# Altium schematic sheet [06] - MICRO CONTROLLER CONNECTORS.SchDoc (part 1 of 2)
size A1; Organization: Altium Limited; Address1: L3, 12a Rodborough Rd; Address2: Frenchs Forest; Address3: NSW; Address4: Australia 2086; DocumentNumber: 6; SheetNumber: 6; SheetTotal: 11
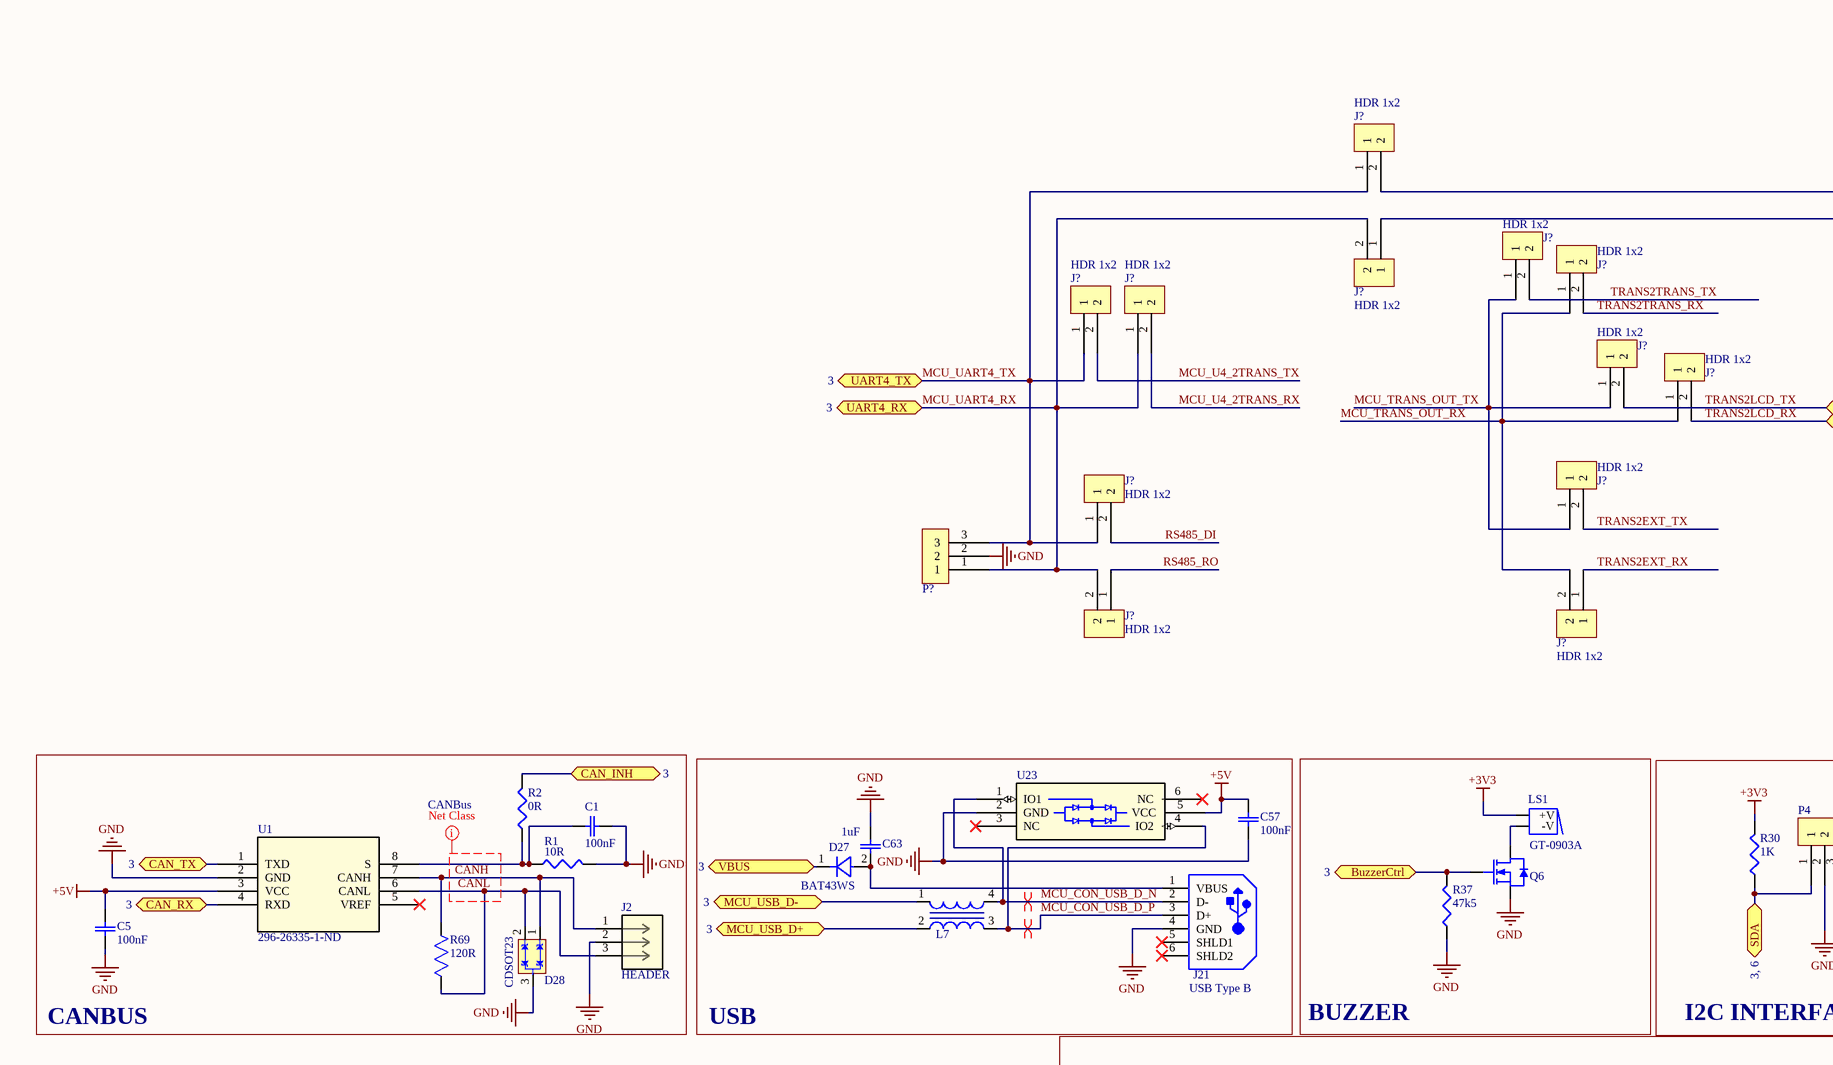
[diagram p0: [06] - MICRO CONTROLLER CONNECTORS.SchDoc, top left]
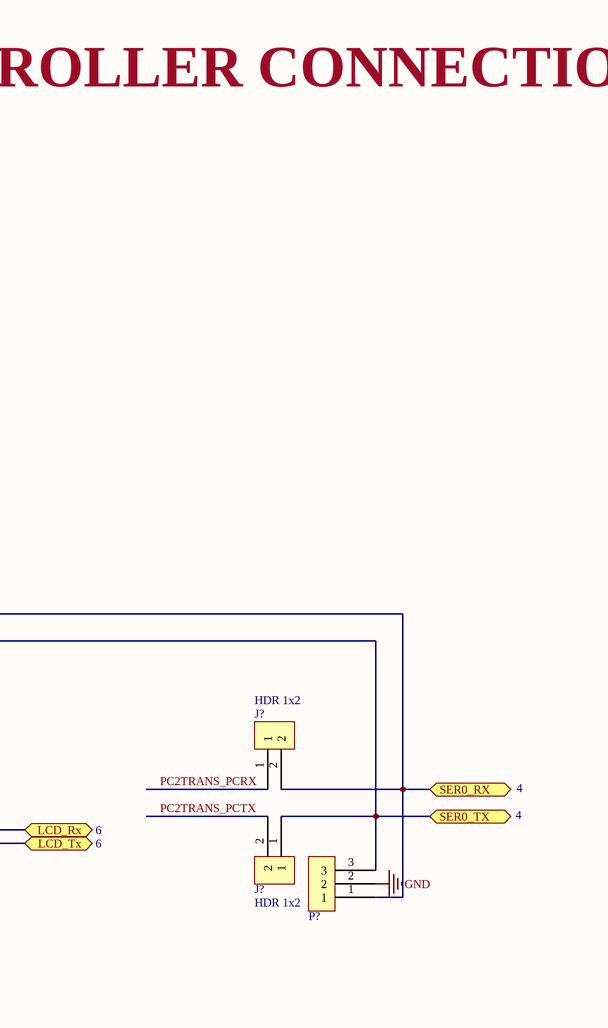
[diagram p1: [06] - MICRO CONTROLLER CONNECTORS.SchDoc, top right]
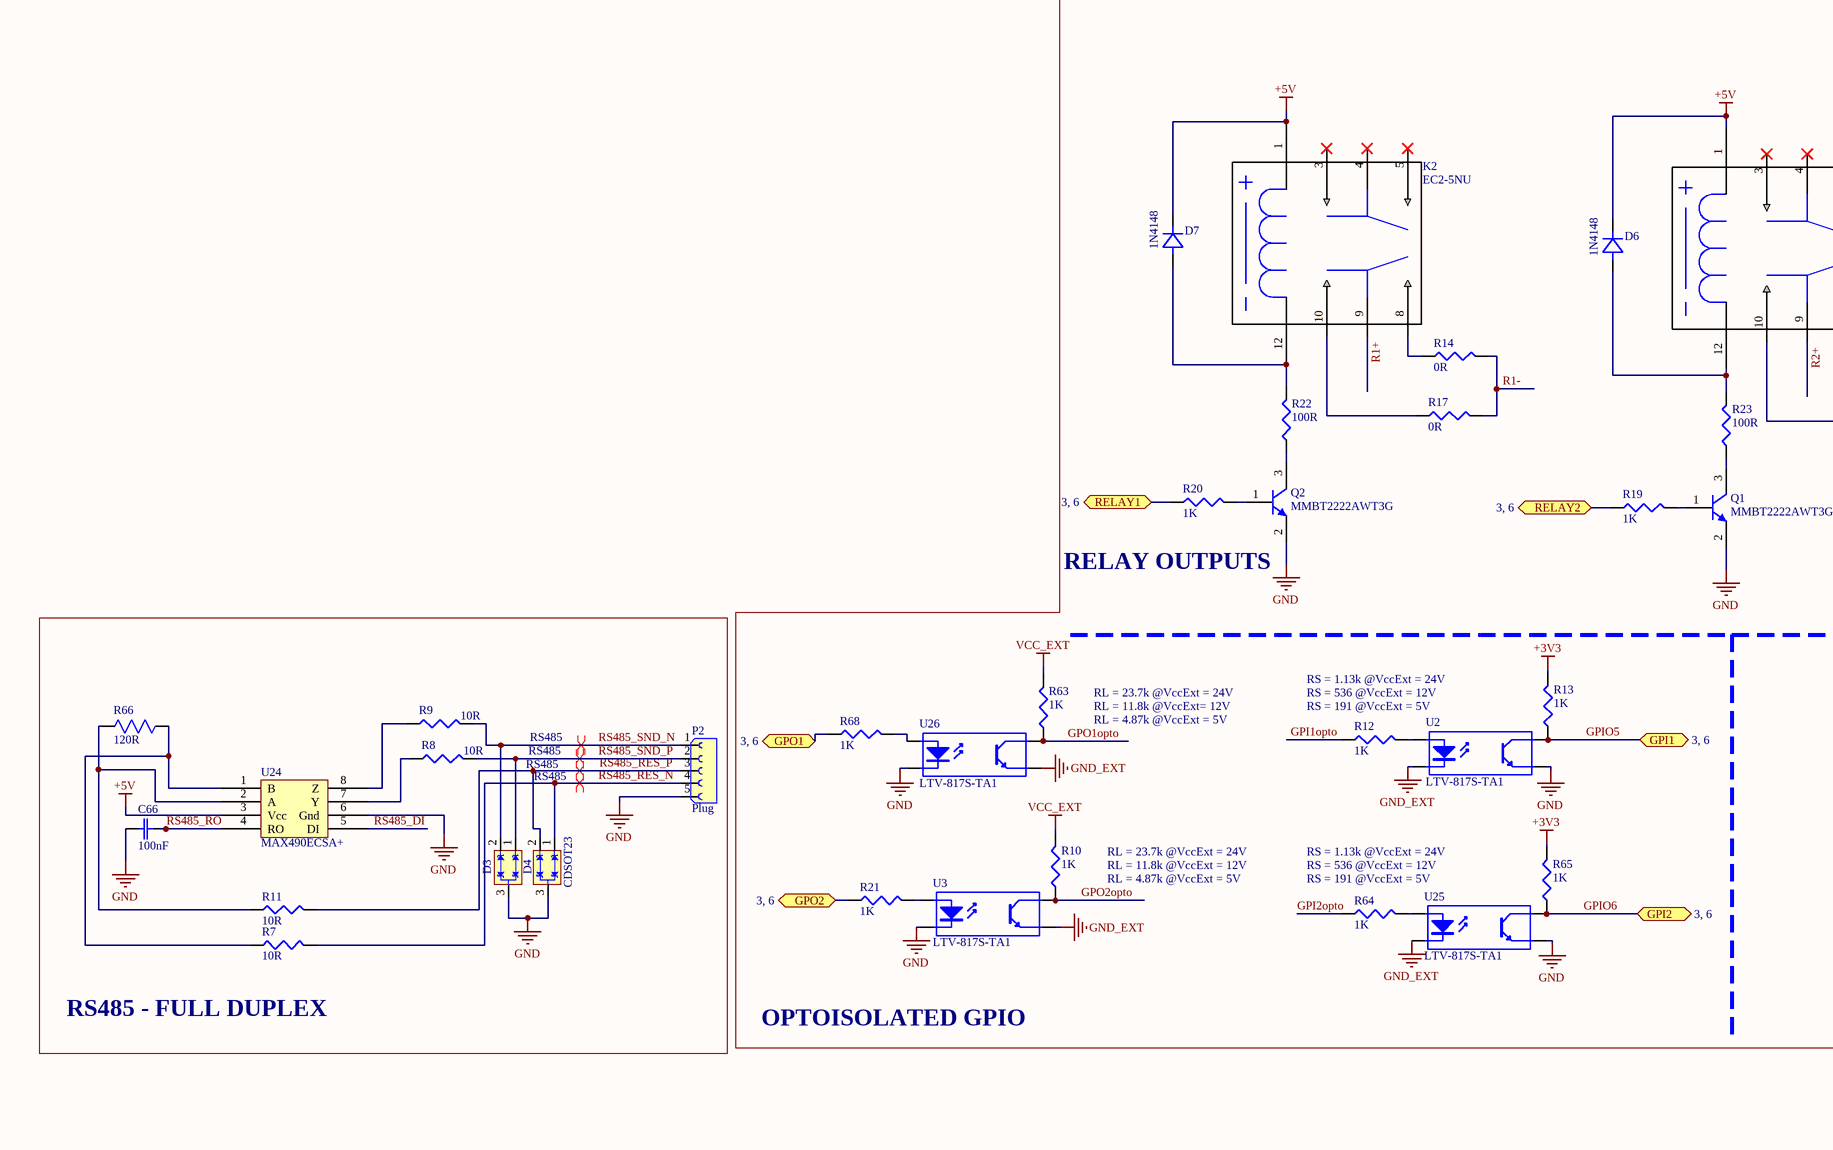
[diagram p2: [06] - MICRO CONTROLLER CONNECTORS.SchDoc, bottom left]
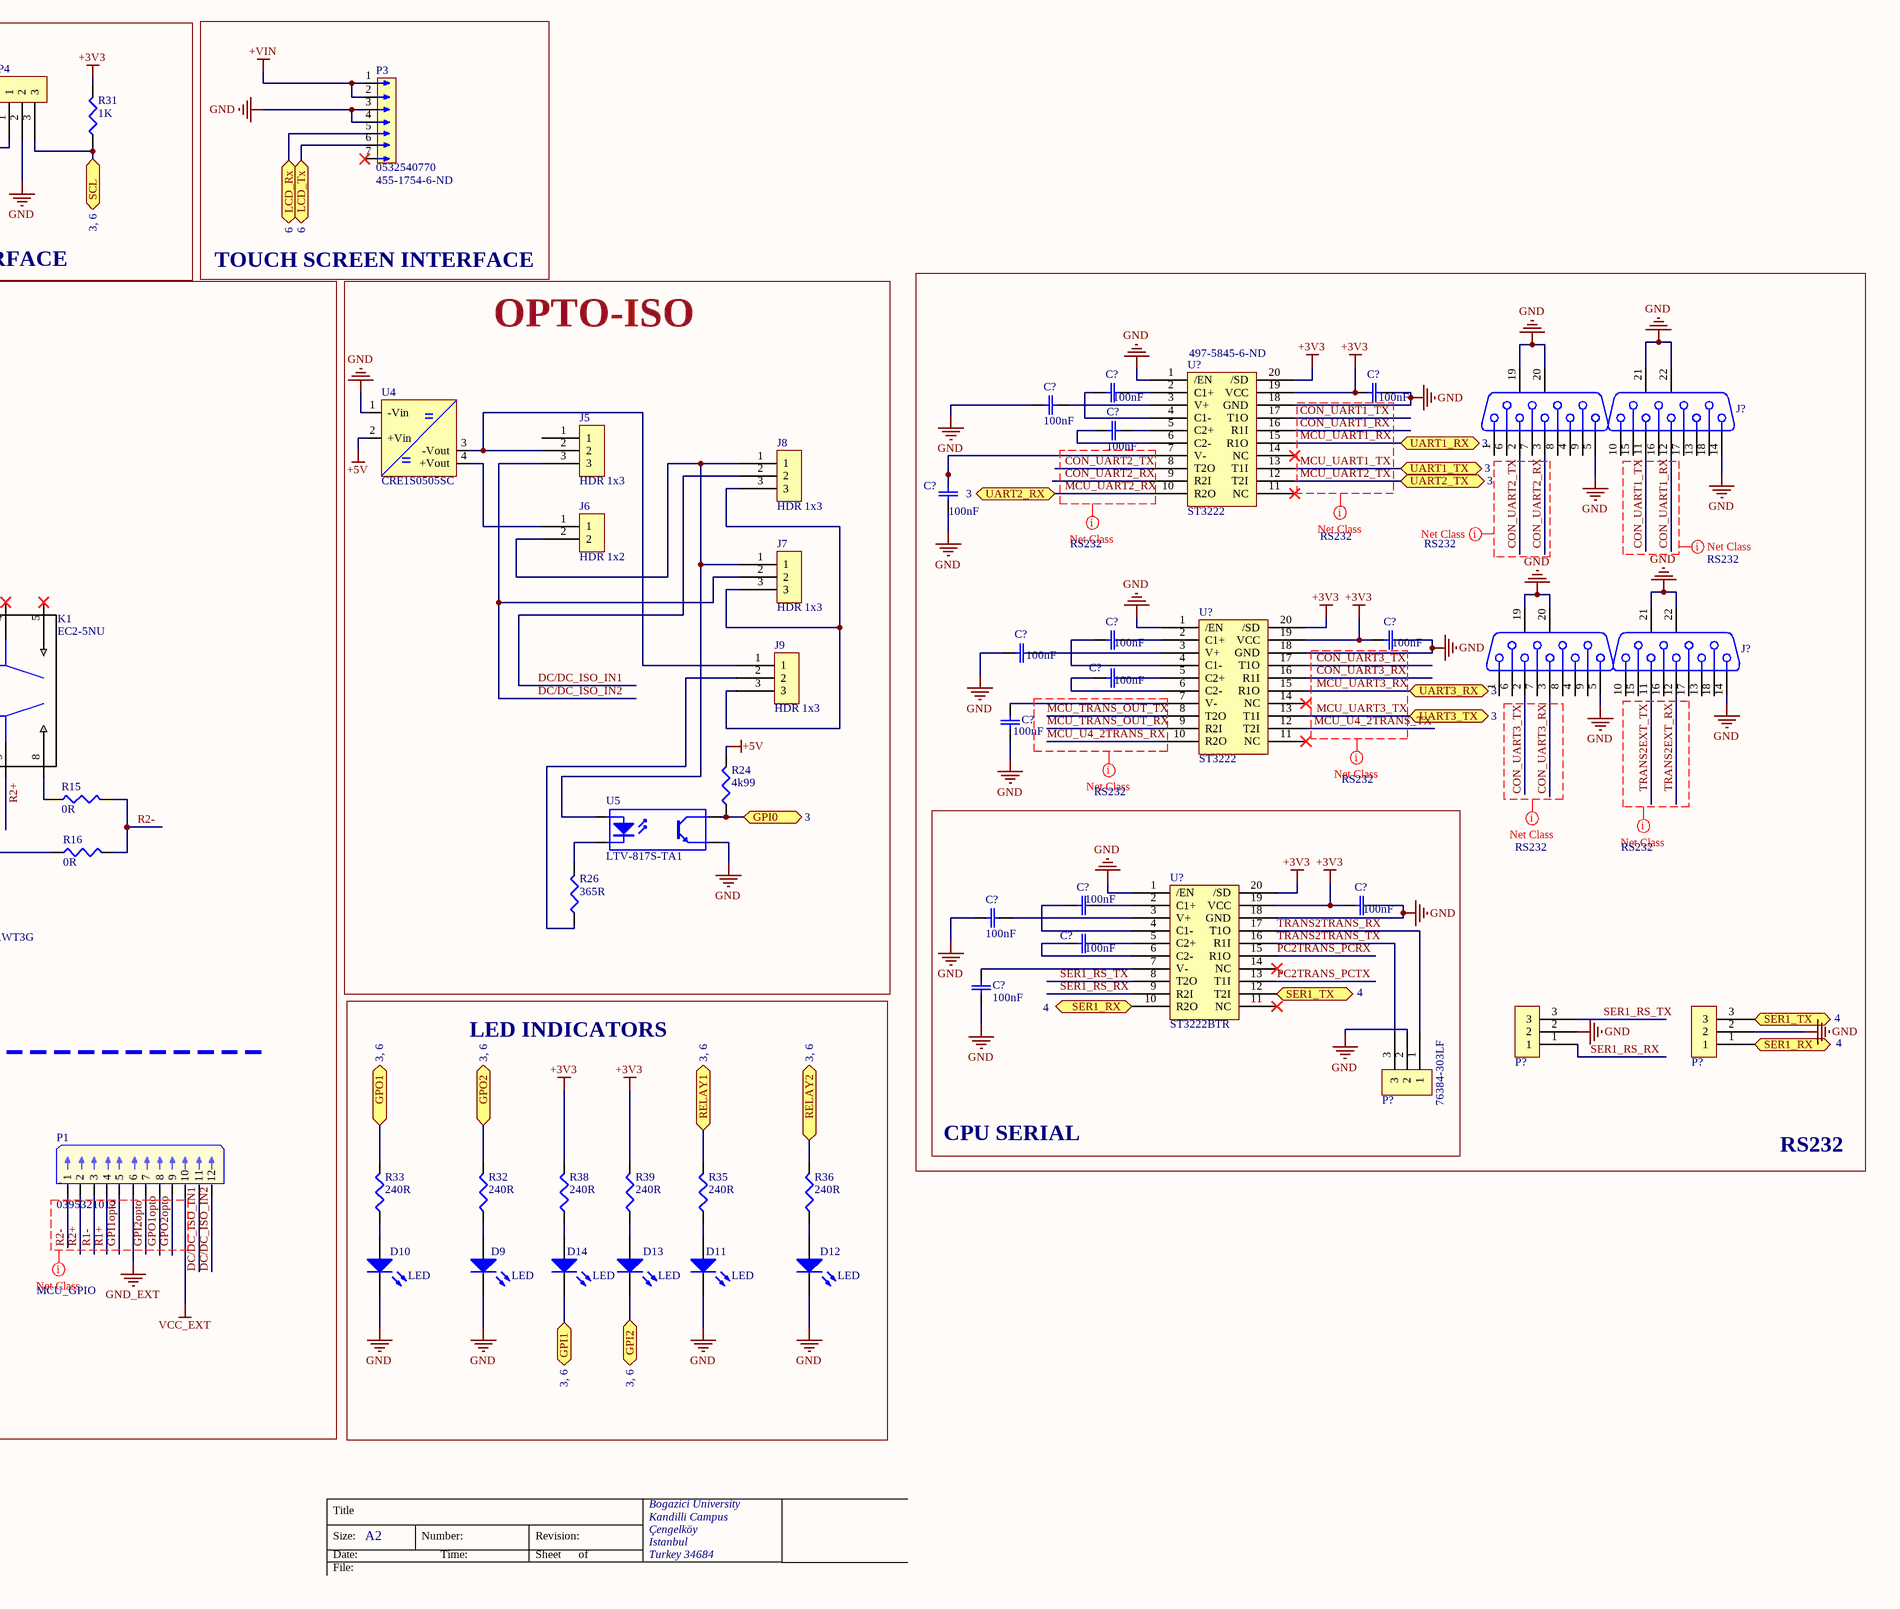
[diagram p3: [06] - MICRO CONTROLLER CONNECTORS.SchDoc, bottom right]

## Parts
(Parts that share a designator on the sheet are numbered #1, #2 ... from top to bottom, then left to right.)
C1  100nF  [C0402]
C5  100nF  [C0402]
C57  100nF  [C0402]
C63  1uF  [CAP_3216]
C66  100nF  [C0402]
C?#1  100nF  [C0402]
C?#2  100nF  [C0402]
C?#3  100nF  [C0402]
C?#4  100nF  [C0402]
C?#5  100nF  [C0402]
C?#6  100nF  [C0402]
C?#7  100nF  [C0402]
C?#8  100nF  [C0402]
C?#9  100nF  [C0402]
C?#10  100nF  [C0402]
C?#11  100nF  [C0402]
C?#12  100nF  [C0402]
C?#13  100nF  [C0402]
C?#14  100nF  [C0402]
C?#15  100nF  [C0402]
D3  CDSOT23  [SOT-23-3]  (value not drawn)
D4  CDSOT23  [SOT-23-3]
D6  1N4148  [SOD123-L]
D7  1N4148  [SOD123-L]
D9  LED  [D0603_Directional]
D10  LED  [D0603_Directional]
D11  LED  [D0603_Directional]
D12  LED  [D0603_Directional]
D13  LED  [D0603_Directional]
D14  LED  [D0603_Directional]
D27  BAT43WS  [SOD323]
D28  CDSOT23  [SOT-23-3]
J2  HEADER  [TerminalBlock3P508]
J5  HDR 1x3  [HDR_1X3_2.54MM]
J6  HDR 1x2  [HDR_1x2_2.54MM]
J7  HDR 1x3  [Hdr_1x3_2.54mm]
J8  HDR 1x3  [Hdr_1x3_2.54mm]
J9  HDR 1x3  [Hdr_1x3_2.54mm]
J21  USB Type B  [USB-B RECEPTACLE]
J?#1  HDR 1x2  [HDR_1x2_2.54MM]
J?#2  HDR 1x2  [HDR_1x2_2.54MM]
J?#3  HDR 1x2  [HDR_1x2_2.54MM]
J?#4  HDR 1x2  [HDR_1x2_2.54MM]
J?#5  HDR 1x2  [HDR_1x2_2.54MM]
J?#6  HDR 1x2  [HDR_1x2_2.54MM]
J?#7  HDR 1x2  [HDR_1x2_2.54MM]
J?#8  HDR 1x2  [HDR_1x2_2.54MM]
J?#9  HDR 1x2  [HDR_1x2_2.54MM]
J?#10  HDR 1x2  [HDR_1x2_2.54MM]
J?#11  HDR 1x2  [HDR_1x2_2.54MM]
J?#12  HDR 1x2  [HDR_1x2_2.54MM]
J?#13  HDR 1x2  [HDR_1x2_2.54MM]
J?#14  HDR 1x2  [HDR_1x2_2.54MM]
J?#15  DSUB-9 Stacked  [DSUB9-Double]  (value not drawn)
J?#16  DSUB-9 Stacked  [DSUB9-Double]  (value not drawn)
K1  EC2-5NU  [EC2NU]
K2  EC2-5NU  [EC2NU]
L7  ACM2012-900-2P-T002  [ACM2012]  (value not drawn)
LS1  GT-0903A  [GT-0903A]
P1  0395321012  [WM7852-ND]
P2  Plug  [691313710005]
P3  0532540770  Supplier Part Number 1: 455-1754-6-ND  [WM3412-ND]
P4  76384-303LF  [HDR_1x3_2.54MM_SHDR_V2]  (value not drawn)
P?#1  76384-303LF  [HDR_1x3_2.54MM_SHDR_V2]  (value not drawn)
P?#2  76384-303LF  [HDR_1x3_2.54MM_SHDR_V2]  (value not drawn)
P?#3  76384-303LF  [HDR_1x3_2.54MM_SHDR_V2]  (value not drawn)
P?#4  76384-303LF  [HDR_1x3_2.54MM_SHDR_V2]  (value not drawn)
P?#5  76384-303LF  [HDR_1X3_2.54MM_SHDR_V2]
Q1  MMBT2222AWT3G  [SC70_SOT323]
Q2  MMBT2222AWT3G  [SC70_SOT323]
Q6  MOSFET N-CH 20V 1A SOT323  [SC70_SOT323]  (value not drawn)
R1  10R  [R0402]
R2  0R  [R0402]
R7  10R  [R0402]
R8  10R  [R0402]
R9  10R  [R0402]
R10  1K  [R0402]
R11  10R  [R0402]
R12  1K  [R0402]
R13  1K  [R0402]
R14  0R  [R0402]
R15  0R  [R0402]
R16  0R  [R0402]
R17  0R  [R0402]
R19  1K  [R0402]
R20  1K  [R0402]
R21  1K  [R0402]
R22  100R  [R0402]
R23  100R  [R0402]
R24  4k99  [R0402]
R26  365R  [R0402]
R30  1K  [R0402]
R31  1K  [R0402]
R32  240R  [R0402]
R33  240R  [R0402]
R35  240R  [R0402]
R36  240R  [R0402]
R37  47k5  [R0402]
R38  240R  [R0402]
R39  240R  [R0402]
R63  1K  [R0402]
R64  1K  [R0402]
R65  1K  [R0402]
R66  120R  [RES_1632]
R68  1K  [R0402]
R69  120R  [RES_1632]
U1  296-26335-1-ND  [D8]
U2  LTV-817S-TA1  [4-SMD-opto]
U3  LTV-817S-TA1  [4-SMD-opto]
U4  CRE1S0505SC  [CRE1S0505SC]
U5  LTV-817S-TA1  [4-SMD-opto]
U23  TVS DIODE 5V 8.1V SOT23-6  [21-0058I]  (value not drawn)
U24  MAX490ECSA+  [21-0041B_8]
U25  LTV-817S-TA1  [4-SMD-opto]
U26  LTV-817S-TA1  [4-SMD-opto]
U?#1  ST3222  Supplier Part Number 1: 497-5845-6-ND  [TSSOP20]
U?#2  ST3222  [TSSOP20]
U?#3  ST3222BTR  [TSSOP20]

## Blocks framed on the sheet
CANBUS: C1 C5 D28 J2 R1 R2 R69 U1
USB: C57 C63 D27 J21 L7 U23
BUZZER: LS1 Q6 R37
I2C INTERFACE: P4 R30 R31
TOUCH SCREEN INTERFACE: P3
OPTO-ISO: J5-J9 R24 R26 U4 U5
RS232: C?#1-C?#10 J?#15 J?#16 P?#3 P?#4 U?#1 U?#2
CPU SERIAL: C?#11-C?#15 P?#5 U?#3
LED INDICATORS: D9-D14 R32 R33 R35 R36 R38 R39
RS485 - FULL DUPLEX: C66 D3 D4 P2 R7-R9 R11 R66 U24

## Ports
BuzzerCtrl (bidir, see 3), CAN_INH (bidir, see 3), CAN_RX (bidir, see 3), CAN_TX (bidir, see 3), GPI0 (bidir, see 3), GPI1 (bidir, see 3, 6), GPI2 (bidir, see 3, 6), GPO1 (bidir, see 3, 6), GPO2 (bidir, see 3, 6), LCD_Rx (bidir, see 6), LCD_Tx (bidir, see 6), MCU_USB_D+ (bidir, see 3), MCU_USB_D- (bidir, see 3), RELAY1 (bidir, see 3, 6), RELAY2 (bidir, see 3, 6), SCL (bidir, see 3, 6), SDA (bidir, see 3, 6), SER0_RX (bidir, see 4), SER0_TX (bidir, see 4), SER1_RX (bidir, see 4), SER1_TX (bidir, see 4), UART1_RX (bidir, see 3), UART1_TX (bidir, see 3), UART2_RX (bidir, see 3), UART2_TX (bidir, see 3), UART3_RX (bidir, see 3), UART3_TX (bidir, see 3), UART4_RX (bidir, see 3), UART4_TX (bidir, see 3), VBUS (see 3)

## Nets
+3V3: C?#2.1 C?#7.2 C?#12.2 LS1.1(+V) R13.2 R30.2 R31.2 R38.2 R39.2 R65.2 U?#1.19(VCC) U?#1.20(/SD) U?#2.19(VCC) U?#2.20(/SD) U?#3.19(VCC) U?#3.20(/SD)
+5V: C5.2 C57.2 D6.1 D7.1 K1.1 K2.1 R24.2 U1.3(VCC) U4.2(+Vin) U23.5(VCC) U24.3(Vcc)
+VIN: P3.1 P3.2
GND: C1.2 C5.1 C57.1 C63.2 C66.1 C?#2.2 C?#3.1 C?#5.1 C?#7.1 C?#8.2 C?#10.2 C?#12.1 C?#13.1 C?#15.1 D3.3 D4.3 D9.2(K) D10.2(K) D11.2(K) D12.2(K) D28.3 J2.2 J21.4(GND) J?#15.5 J?#15.14 J?#15.19 J?#15.20 J?#15.21 J?#15.22 J?#16.5 J?#16.14 J?#16.19 J?#16.20 J?#16.21 J?#16.22 P2.5 P3.3 P3.4 P4.2 P?#1.2 P?#2.2 P?#3.2 P?#4.2 P?#5.2 Q1.2(E) Q2.2(E) Q6.2(S) R1.2 R37.1 U1.2(GND) U2.3(E) U3.2(K) U4.1(-Vin) U5.3(E) U23.2(GND) U24.6(Gnd) U25.3(E) U26.2(K) U?#1.1(/EN) U?#1.18(GND) U?#2.1(/EN) U?#2.18(GND) U?#3.1(/EN) U?#3.18(GND)
GND_EXT: P1.6 U2.2(K) U3.3(E) U25.2(K) U26.3(E)
VCC_EXT: P1.10 R10.2 R63.2
BuzzerCtrl: Q6.1(G) R37.2 ; port BuzzerCtrl
CAN_INH: R2.2 ; port CAN_INH
CAN_RX: U1.4(RXD) ; port CAN_RX
CAN_TX: U1.1(TXD) ; port CAN_TX
CANH: D28.1 J2.1 R69.2 U1.7(CANH)
CANL: D28.2 J2.3 R69.1 U1.6(CANL)
CON_UART1_RX: J?#15.12 U?#1.16(R1I)
CON_UART1_TX: J?#15.11 U?#1.17(T1O)
CON_UART2_RX: J?#15.3 U?#1.9(R2I)
CON_UART2_TX: J?#15.2 U?#1.8(T2O)
CON_UART3_RX: J?#16.3 U?#2.16(R1I)
CON_UART3_TX: J?#16.2 U?#2.17(T1O)
DC/DC_ISO_IN1: J8.2 P1.11
DC/DC_ISO_IN2: J5.3 J7.2 P1.12
GPI0: R24.1 U5.4(C) ; port GPI0
GPI1opto: P1.5 R12.1
GPI2opto: P1.7 R64.1
GPIO5: D14.2(K) R13.1 U2.4(C) ; port GPI1
GPIO6: D13.2(K) R65.1 U25.4(C) ; port GPI2
GPO1: R33.2 R68.1 ; port GPO1
GPO1opto: P1.8 R63.1 U26.4(C)
GPO2: R21.1 R32.2 ; port GPO2
GPO2opto: P1.9 R10.1 U3.4(C)
MCU_CON_USB_D_N: J21.2(D-) L7.4 U23.1(IO1)
MCU_CON_USB_D_P: J21.3(D+) L7.3 U23.4(IO2)
MCU_TRANS_OUT_RX: J?#3.1 J?#9.1 J?#14.2 U?#2.9(R2I)
MCU_TRANS_OUT_TX: J?#2.1 J?#8.1 J?#11.1 U?#2.8(T2O)
MCU_U4_2TRANS_RX: J?#6.2 U?#2.10(R2O)
MCU_U4_2TRANS_TX: J?#5.2 U?#2.12(T2I)
MCU_UART1_RX: U?#1.15(R1O) ; port UART1_RX
MCU_UART1_TX: U?#1.13(T1I) ; port UART1_TX
MCU_UART2_RX: U?#1.10(R2O) ; port UART2_RX
MCU_UART2_TX: U?#1.12(T2I) ; port UART2_TX
MCU_UART3_RX: U?#2.15(R1O) ; port UART3_RX
MCU_UART3_TX: U?#2.13(T1I) ; port UART3_TX
MCU_UART4_RX: J?#4.2 J?#6.1 J?#13.2 P?#2.1 ; port UART4_RX
MCU_UART4_TX: J?#1.1 J?#5.1 J?#12.1 P?#2.3 ; port UART4_TX
MCU_USB_D+: L7.2 ; port MCU_USB_D+
MCU_USB_D-: L7.1 ; port MCU_USB_D-
PC2TRANS_PCRX: J?#7.1 U?#3.15(R1O)
PC2TRANS_PCTX: J?#10.2 U?#3.13(T1I)
R1+: K2.9 P1.4
R1-: P1.3 R14.2 R17.2
R2+: K1.9 P1.2
R2-: P1.1 R15.2 R16.2
RELAY1: R20.1 R35.2 ; port RELAY1
RELAY2: R19.1 R36.2 ; port RELAY2
RS485_DI: J?#12.2 U24.5(DI)
RS485_RES_N: D4.1 P2.4 R7.2
RS485_RES_P: D4.2 P2.3 R11.2
RS485_RO: C66.2 J?#13.1 U24.4(RO)
RS485_SND_N: D3.2 P2.1 R9.2
RS485_SND_P: D3.1 P2.2 R8.2
SCL: P4.3 R31.1 ; port SCL
SDA: P4.1 R30.1 ; port SDA
SER0_RX: J?#1.2 J?#7.2 P?#1.1 ; port SER0_RX
SER0_TX: J?#4.1 J?#10.1 P?#1.3 ; port SER0_TX
SER1_RS_RX: P?#3.1 U?#3.9(R2I)
SER1_RS_TX: P?#3.3 U?#3.8(T2O)
SER1_RX: P?#4.1 U?#3.10(R2O) ; port SER1_RX
SER1_TX: P?#4.3 U?#3.12(T2I) ; port SER1_TX
TRANS2EXT_RX: J?#14.1 J?#16.12
TRANS2EXT_TX: J?#11.2 J?#16.11
TRANS2LCD_RX: J?#9.2 P3.6 ; port LCD_Tx
TRANS2LCD_TX: J?#8.2 P3.5 ; port LCD_Rx
TRANS2TRANS_RX: J?#3.2 P?#5.1 U?#3.17(T1O)
TRANS2TRANS_TX: J?#2.2 P?#5.3 U?#3.16(R1I)
VBUS: D27.1 ; port VBUS
NetC1_1: C1.1 R1.1 R2.1 U1.8(S)
NetC63_1: C63.1 D27.2 J21.1(VBUS)
NetC?#1_1: C?#1.1 U?#1.4(C1-)
NetC?#1_2: C?#1.2 U?#1.2(C1+)
NetC?#3_2: C?#3.2 U?#1.3(V+)
NetC?#4_1: C?#4.1 U?#1.6(C2-)
NetC?#4_2: C?#4.2 U?#1.5(C2+)
NetC?#5_2: C?#5.2 U?#1.7(V-)
NetC?#6_1: C?#6.1 U?#2.2(C1+)
NetC?#6_2: C?#6.2 U?#2.4(C1-)
NetC?#8_1: C?#8.1 U?#2.3(V+)
NetC?#9_1: C?#9.1 U?#2.5(C2+)
NetC?#9_2: C?#9.2 U?#2.6(C2-)
NetC?#10_1: C?#10.1 U?#2.7(V-)
NetC?#11_1: C?#11.1 U?#3.2(C1+)
NetC?#11_2: C?#11.2 U?#3.4(C1-)
NetC?#13_2: C?#13.2 U?#3.3(V+)
NetC?#14_1: C?#14.1 U?#3.5(C2+)
NetC?#14_2: C?#14.2 U?#3.6(C2-)
NetC?#15_2: C?#15.2 U?#3.7(V-)
NetD6_2: D6.2 K1.12 R23.2
NetD7_2: D7.2 K2.12 R22.2
NetD9_1: D9.1(A) R32.1
NetD10_1: D10.1(A) R33.1
NetD11_1: D11.1(A) R35.1
NetD12_1: D12.1(A) R36.1
NetD13_1: D13.1(A) R39.1
NetD14_1: D14.1(A) R38.1
NetJ5_2: J5.2 J9.1 U4.3(-Vout)
NetJ6_1: J6.1 U4.4(+Vout)
NetJ6_2: J6.2 J7.1 J8.1 U5.1(A)
NetJ7_3: J7.3 J8.3 J9.3
NetJ9_2: J9.2 R26.1
NetK1_8: K1.8 R15.1
NetK1_10: K1.10 R16.1
NetK2_8: K2.8 R14.1
NetK2_10: K2.10 R17.1
NetLS1_2: LS1.2(-V) Q6.3(D)
NetQ1_1: Q1.1(B) R19.2
NetQ1_3: Q1.3(C) R23.1
NetQ2_1: Q2.1(B) R20.2
NetQ2_3: Q2.3(C) R22.1
NetR7_1: R7.1 R66.2 U24.1(B)
NetR8_1: R8.1 U24.7(Y)
NetR9_1: R9.1 U24.8(Z)
NetR11_1: R11.1 R66.1 U24.2(A)
NetR12_2: R12.2 U2.1(A)
NetR21_2: R21.2 U3.1(A)
NetR26_2: R26.2 U5.2(K)
NetR64_2: R64.2 U25.1(A)
NetR68_2: R68.2 U26.1(A)

Not connected (* = marked no-connect by the designer): J5 1; J21 5(SHLD1)* 6(SHLD2)*; J?#15 1 4 6 7 8 9 10 13 15 16 17 18; J?#16 1 4 6 7 8 9 10 13 15 16 17 18; K1 3 4 5; K2 3 4 5; P3 7*; U1 5(VREF)*; U23 3(NC)* 6(NC)*; U?#1 11(NC)* 14(NC)*; U?#2 11(NC)* 14(NC)*; U?#3 11(NC)* 14(NC)*

## Layout directives
net class CANBus: CANH, CANL
differential pair; net class MCU_USB: MCU_CON_USB_D_N, MCU_CON_USB_D_P
net class MCU_GPIO: GPI1opto, GPI2opto, GPO1opto, GPO2opto, R1+, R1-, R2+, R2-
differential pair; net class RS485: RS485_RES_N, RS485_RES_P, RS485_SND_N, RS485_SND_P
net class RS232: CON_UART1_RX, CON_UART1_TX, CON_UART2_RX, CON_UART2_TX, CON_UART3_RX, CON_UART3_TX, MCU_TRANS_OUT_RX, MCU_TRANS_OUT_TX, MCU_U4_2TRANS_RX, MCU_U4_2TRANS_TX, MCU_UART1_RX, MCU_UART1_TX, MCU_UART2_RX, MCU_UART2_TX, MCU_UART3_RX, MCU_UART3_TX, TRANS2EXT_RX, TRANS2EXT_TX

## Notes on the sheet
- MICRO-CONTROLLER CONNECTIONS
- RELAY OUTPUTS
- RL = 23.7k @VccExt = 24V
- RL = 11.8k @VccExt= 12V
- RL = 4.87k @VccExt = 5V
- RS = 1.13k @VccExt = 24V
- RS = 536 @VccExt = 12V
- RS = 191 @VccExt = 5V
- RL = 11.8k @VccExt = 12V
- OPTOISOLATED GPIO
- Title
- Bogazici University
- Size:
- Date:
- File:
- A2
- Number:
- Time:
- Revision:
- Sheet
- of
- Kandilli Campus
- Çengelköy
- Istanbul
- Turkey 34684